# EasyEDA schematic Task 10.1DHD 02_2021-05-30.json
TITLE: Sheet_1; REV: 1.0; Date: 2021-05-30; Sheet: 1/1; Company: Your Company
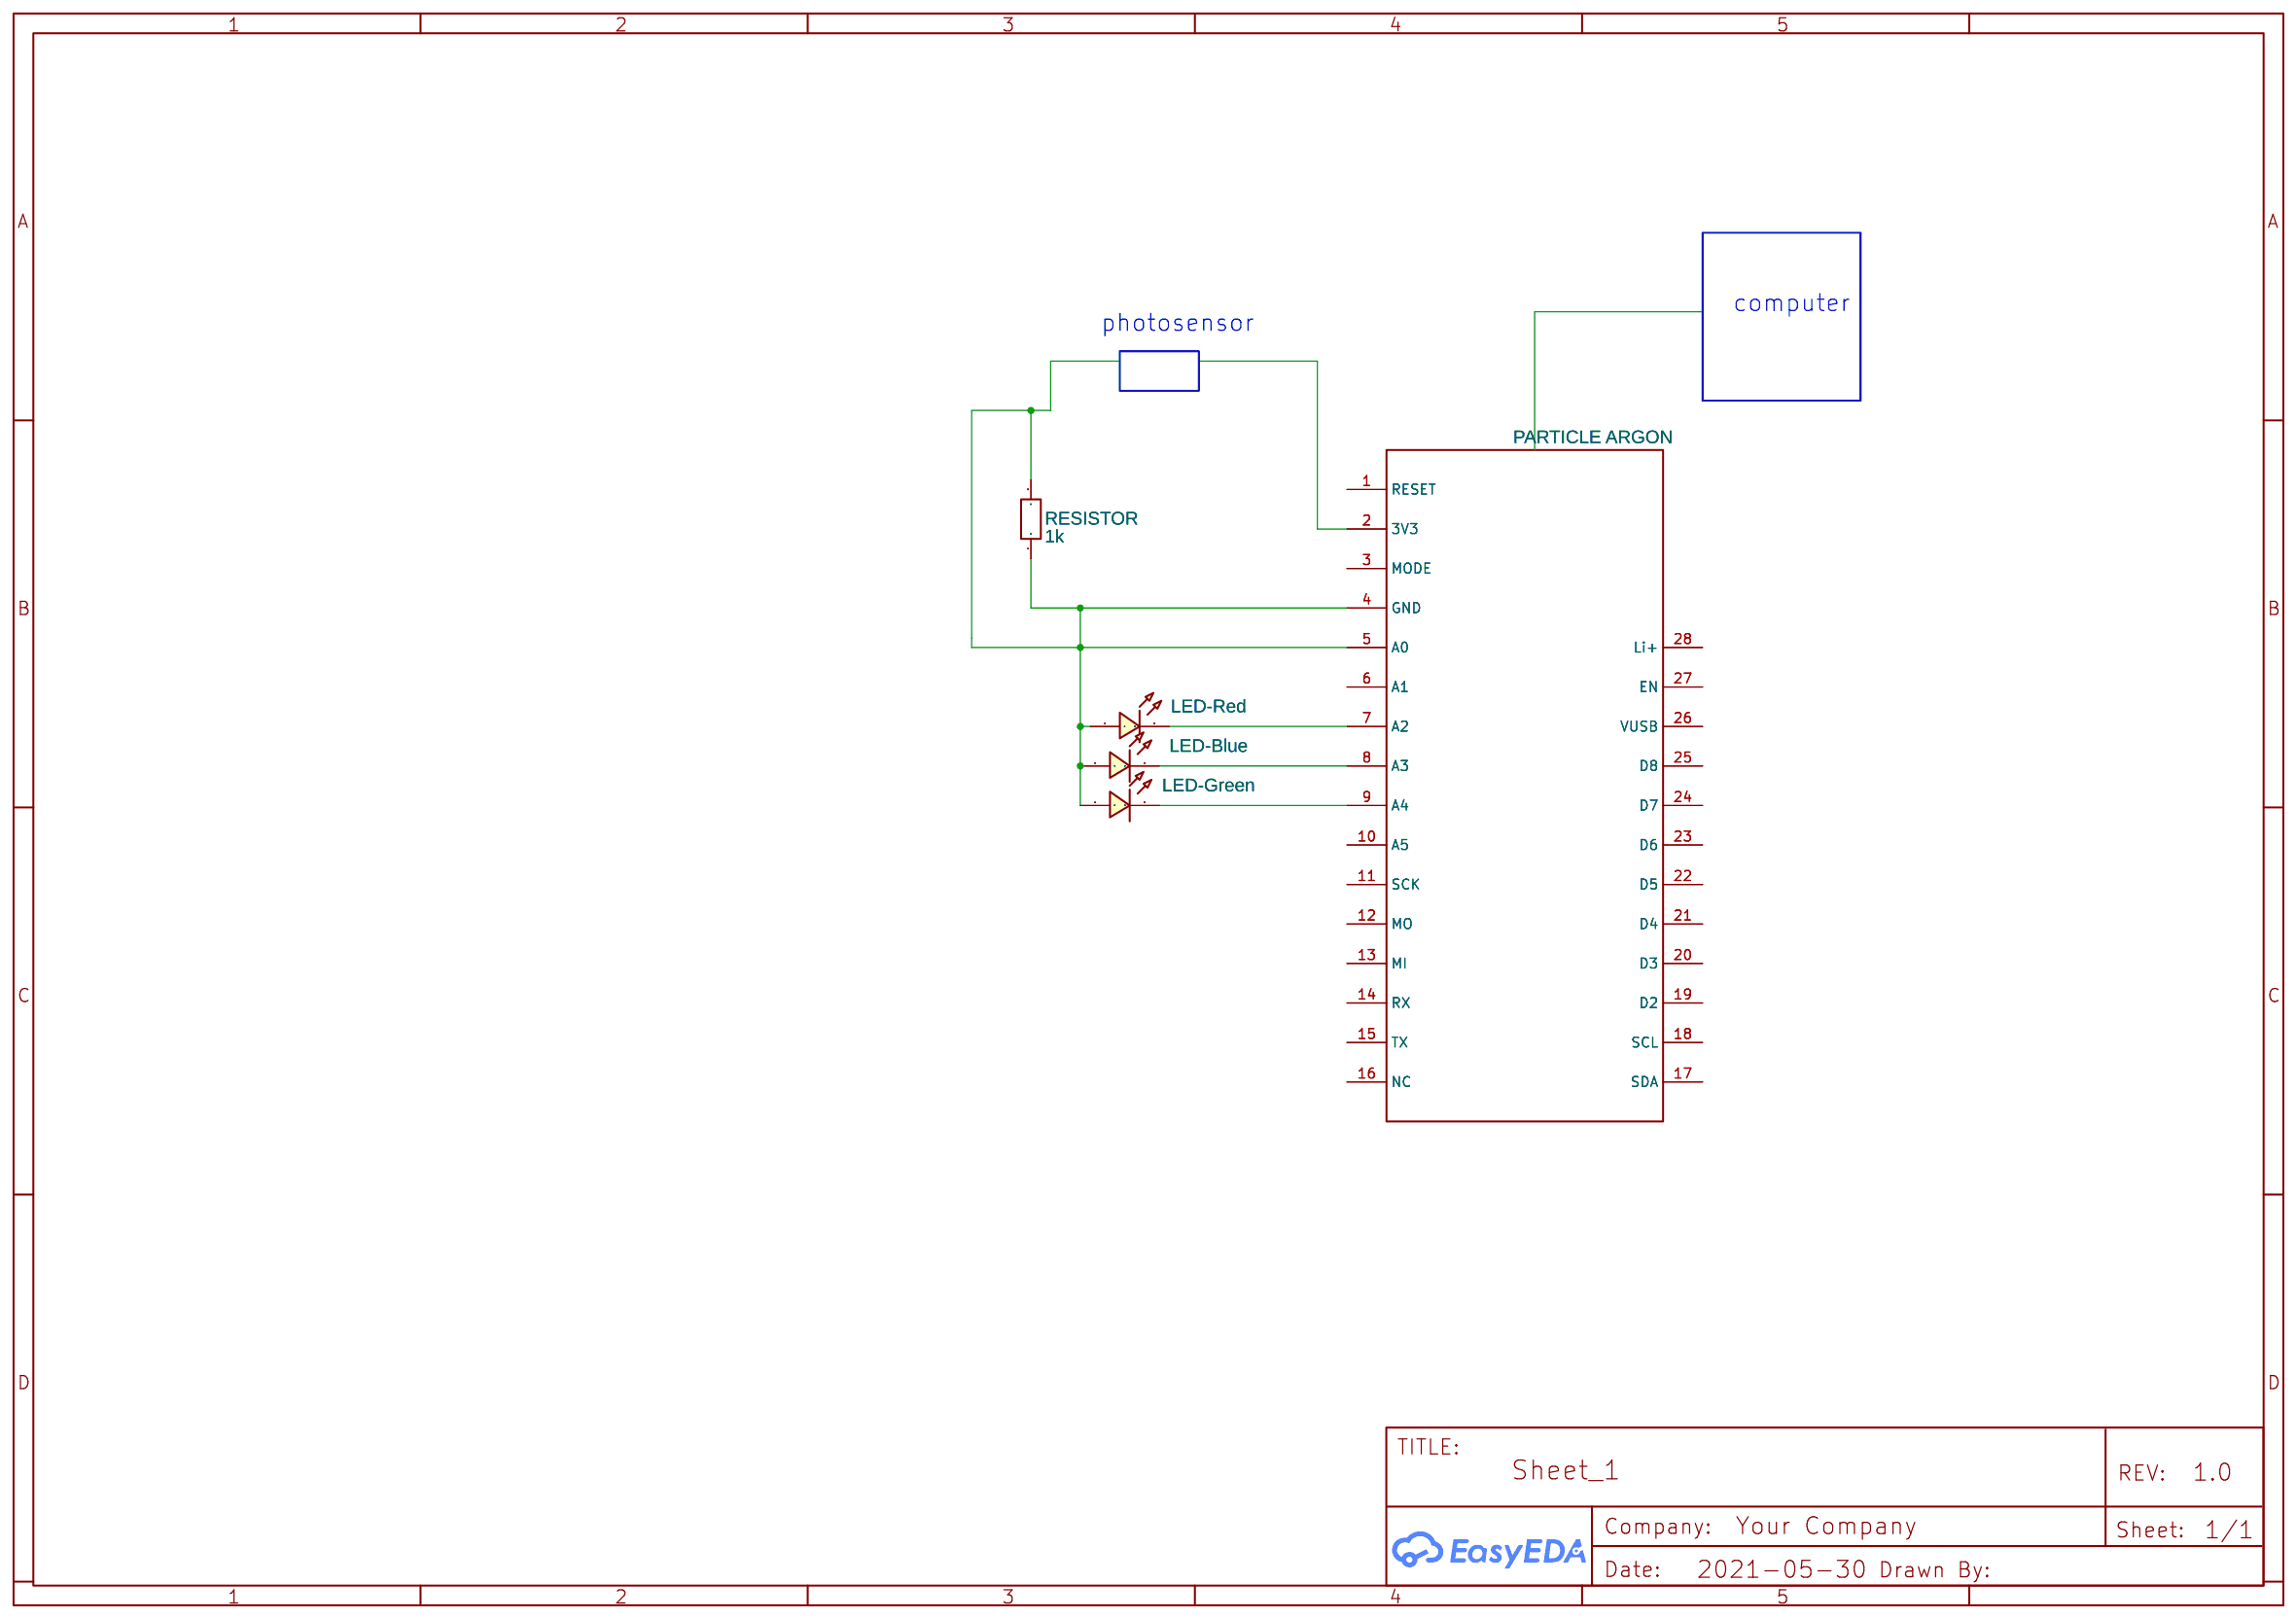
[diagram p0: schematic sheet]

## Parts
LED2  LED-Green  [LED0603_RED]
LED3  LED-Blue  [LED0603_RED]
LED4  LED-Red  [LED0603_RED]
RESISTOR  1k  [R0603]
U1  PARTICLE ARGON  [PARTICLE_XENON]

## Library data of the parts
LED2-LED4 = LED-0603_R: Manufacturer: EVERLIGHT(台湾亿光); Manufacturer Part: 19-217/R6C-AL1M2VY/3T; Supplier Part: C72044; Supplier: LCSC; Contributor: LCEDA_01; Package Display: No
RESISTOR = R_0603_EU: Contributor: LCEDA_Lib
U1 = PARTICLE ARGON: Contributor: farm21

## Nets
Net-(LED2-1): LED2.1 LED3.1 LED4.1 RESISTOR.1 RESISTOR.2 U1.4(GND) U1.5(A0)
Net-(LED2-2): LED2.2 U1.9(A4)
Net-(LED3-2): LED3.2 U1.8(A3)
Net-(LED4-2): LED4.2 U1.7(A2)

Not connected (* = marked no-connect by the designer): U1 1(RESET) 2(3V3) 3(MODE) 6(A1) 10(A5) 11(SCK) 12(MO) 13(MI) 14(RX) 15(TX) 16(NC) 17(SDA) 18(SCL) 19(D2) 20(D3) 21(D4) 22(D5) 23(D6) 24(D7) 25(D8) 26(VUSB) 27(EN) 28(Li+)

## Notes on the sheet
- computer
- photosensor
